# Altium schematic sheet 13_AdditionalFunction.SchDoc
size A4; Organization: OLTEST; Revision: 01; SheetNumber: 13; SheetTotal: 13; Название листа: Название листа; Разработчик: Бондарчук С.; Прибор: R100; АМАК.000000.000 Э3: R100.230.030.000-00; Дата: 16.04.2019; Формат: A4; workspacename: R100_Boards_v1
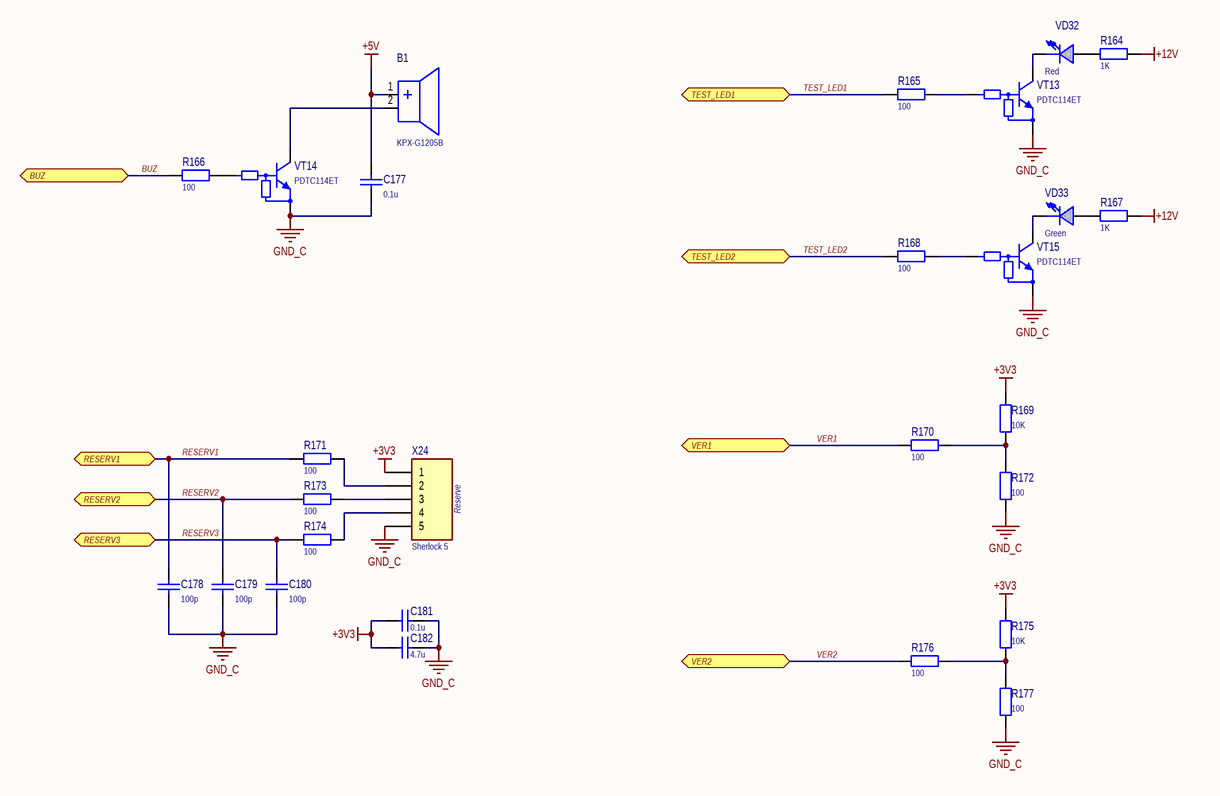
[diagram p0: 13_AdditionalFunction.SchDoc]

## Parts
B1  KPX-G1205B  [KPX-G12]
C177  0.1u  [SMD_C_0603]
C178  100p  [SMD_C_0603]
C179  100p  [SMD_C_0603]
C180  100p  [SMD_C_0603]
C181  0.1u  [SMD_C_0603]
C182  4.7u  [SMD_C_0805]
R164  1K  [SMD_R_1206]
R165  100  [SMD_R_0603]
R166  100  [SMD_R_0603]
R167  1K  [SMD_R_1206]
R168  100  [SMD_R_0603]
R169  10K  [SMD_R_0603]
R170  100  [SMD_R_0603]
R171  100  [SMD_R_0603]
R172  100  [SMD_R_0603]
R173  100  [SMD_R_0603]
R174  100  [SMD_R_0603]
R175  10K  [SMD_R_0603]
R176  100  [SMD_R_0603]
R177  100  [SMD_R_0603]
VD32  value Red  [SMD_LED_LL_Red]  (hidden comment: LL-S172SC-2S)
VD33  value Green  [SMD_LED_LL_Green]  (hidden comment: LL-S172GC-2A)
VT13  PDTC114ET  [SOT23-3]
VT14  PDTC114ET  [SOT23-3]
VT15  PDTC114ET  [SOT23-3]
X24  Sherlock 5  [35362-0550]

## Ports
BUZ, RESERV1, RESERV2, RESERV3, TEST_LED1, TEST_LED2, VER1, VER2

## Nets
+3V3: C181.1 C182.1 R169.2 R175.2 X24.1
+5V: B1.1(+) C177.2
+12V: R164.2 R167.2
GND_C: C177.1 C178.1 C179.1 C180.1 C181.2 C182.2 R172.1 R177.1 VT13.2(E) VT14.2(E) VT15.2(E) X24.5
BUZ: R166.1 ; port BUZ
RESERV1: C178.2 R171.1 ; port RESERV1
RESERV2: C179.2 R173.1 ; port RESERV2
RESERV3: C180.2 R174.1 ; port RESERV3
TEST_LED1: R165.1 ; port TEST_LED1
TEST_LED2: R168.1 ; port TEST_LED2
VER1: R170.1 ; port VER1
VER2: R176.1 ; port VER2
NetB1_2: B1.2(-) VT14.3(C)
NetR164_1: R164.1 VD32.1(ANODE)
NetR165_2: R165.2 VT13.1(B)
NetR166_2: R166.2 VT14.1(B)
NetR167_1: R167.1 VD33.1(ANODE)
NetR168_2: R168.2 VT15.1(B)
NetR169_1: R169.1 R170.2 R172.2
NetR171_2: R171.2 X24.2
NetR173_2: R173.2 X24.3
NetR174_2: R174.2 X24.4
NetR175_1: R175.1 R176.2 R177.2
NetVD32_2: VD32.2(CATHODE) VT13.3(C)
NetVD33_2: VD33.2(CATHODE) VT15.3(C)

## Notes on the sheet
- (near X24) Reserve
- Разработчик:
- Формат:
- Rev.:
- Лист
- Дата:
- Листов
- WorkSpace:
- Дата изм.:

## Library data of the parts
B1 = KPX-G1205B: Magnetic Buzzer; Manufacturer: KEPO; PartNumber: KPX-G1205B
C177 C181 = C0603 0.1u 50V 10%: SMD C 0603 MURATA 50V 10% X7R; PartNumber: GRM188R71H104K; Manufacturer: MURATA; Value: 0.1u
C178-C180 = C0603 100p 100V 5%: SMD C 0603 MURATA 100V 5% NP0; PartNumber: GRM1885C2A101JA01; Manufacturer: MURATA; Value: 100p
C182 = C0805 4.7u 25V 20%  X5R: SMD C 0805 MURATA 50V 5% NP0; PartNumber: GRM21BR61E475M; Manufacturer: MURATA; Value: 4.7u
R164 R167 = R1206 1K 1%: SMD R 1206 VISHAY 0.25W 200V 1% 100ppm; PartNumber: CRCW12061K00FK; Manufacturer: VISHAY; Value: 1K
R165 R166 R168 R170-R174 R176 R177 = R0603 100 1%: SMD R 0603 VISHAY 0.1W 75V 1% 100ppm; PartNumber: CRCW0603100RFK; Manufacturer: VISHAY; Value: 100
R169 R175 = R0603 10К 1%: SMD R 0603 VISHAY 0.1W 75V 1% 100ppm; PartNumber: CRCW060310K0FK; Manufacturer: VISHAY; Value: 10K
VD32 = LL-S172SC-2S: LED Red SMD; Manufacturer: Lucky Light; PartNumber: LL-S172SC-2S
VD33 = LL-S172GC-2A: LED Green SMD; Manufacturer: Lucky Light; PartNumber: LL-S172GC-2A
VT13-VT15 = PDTC114ET: Digital Transistor (BRT), R1=10 kOhm, R2=10 kOhm, NPN Transistor; Manufacturer: On Semiconductor; PartNumber: PDTC114ET
X24 = 35362-0550: Sherlock 5 Top, 2A 125V 2mm; Manufacturer: MOLEX; PartNumber: 35362-0550